# Altium project PCB_Project2.PrjPCB
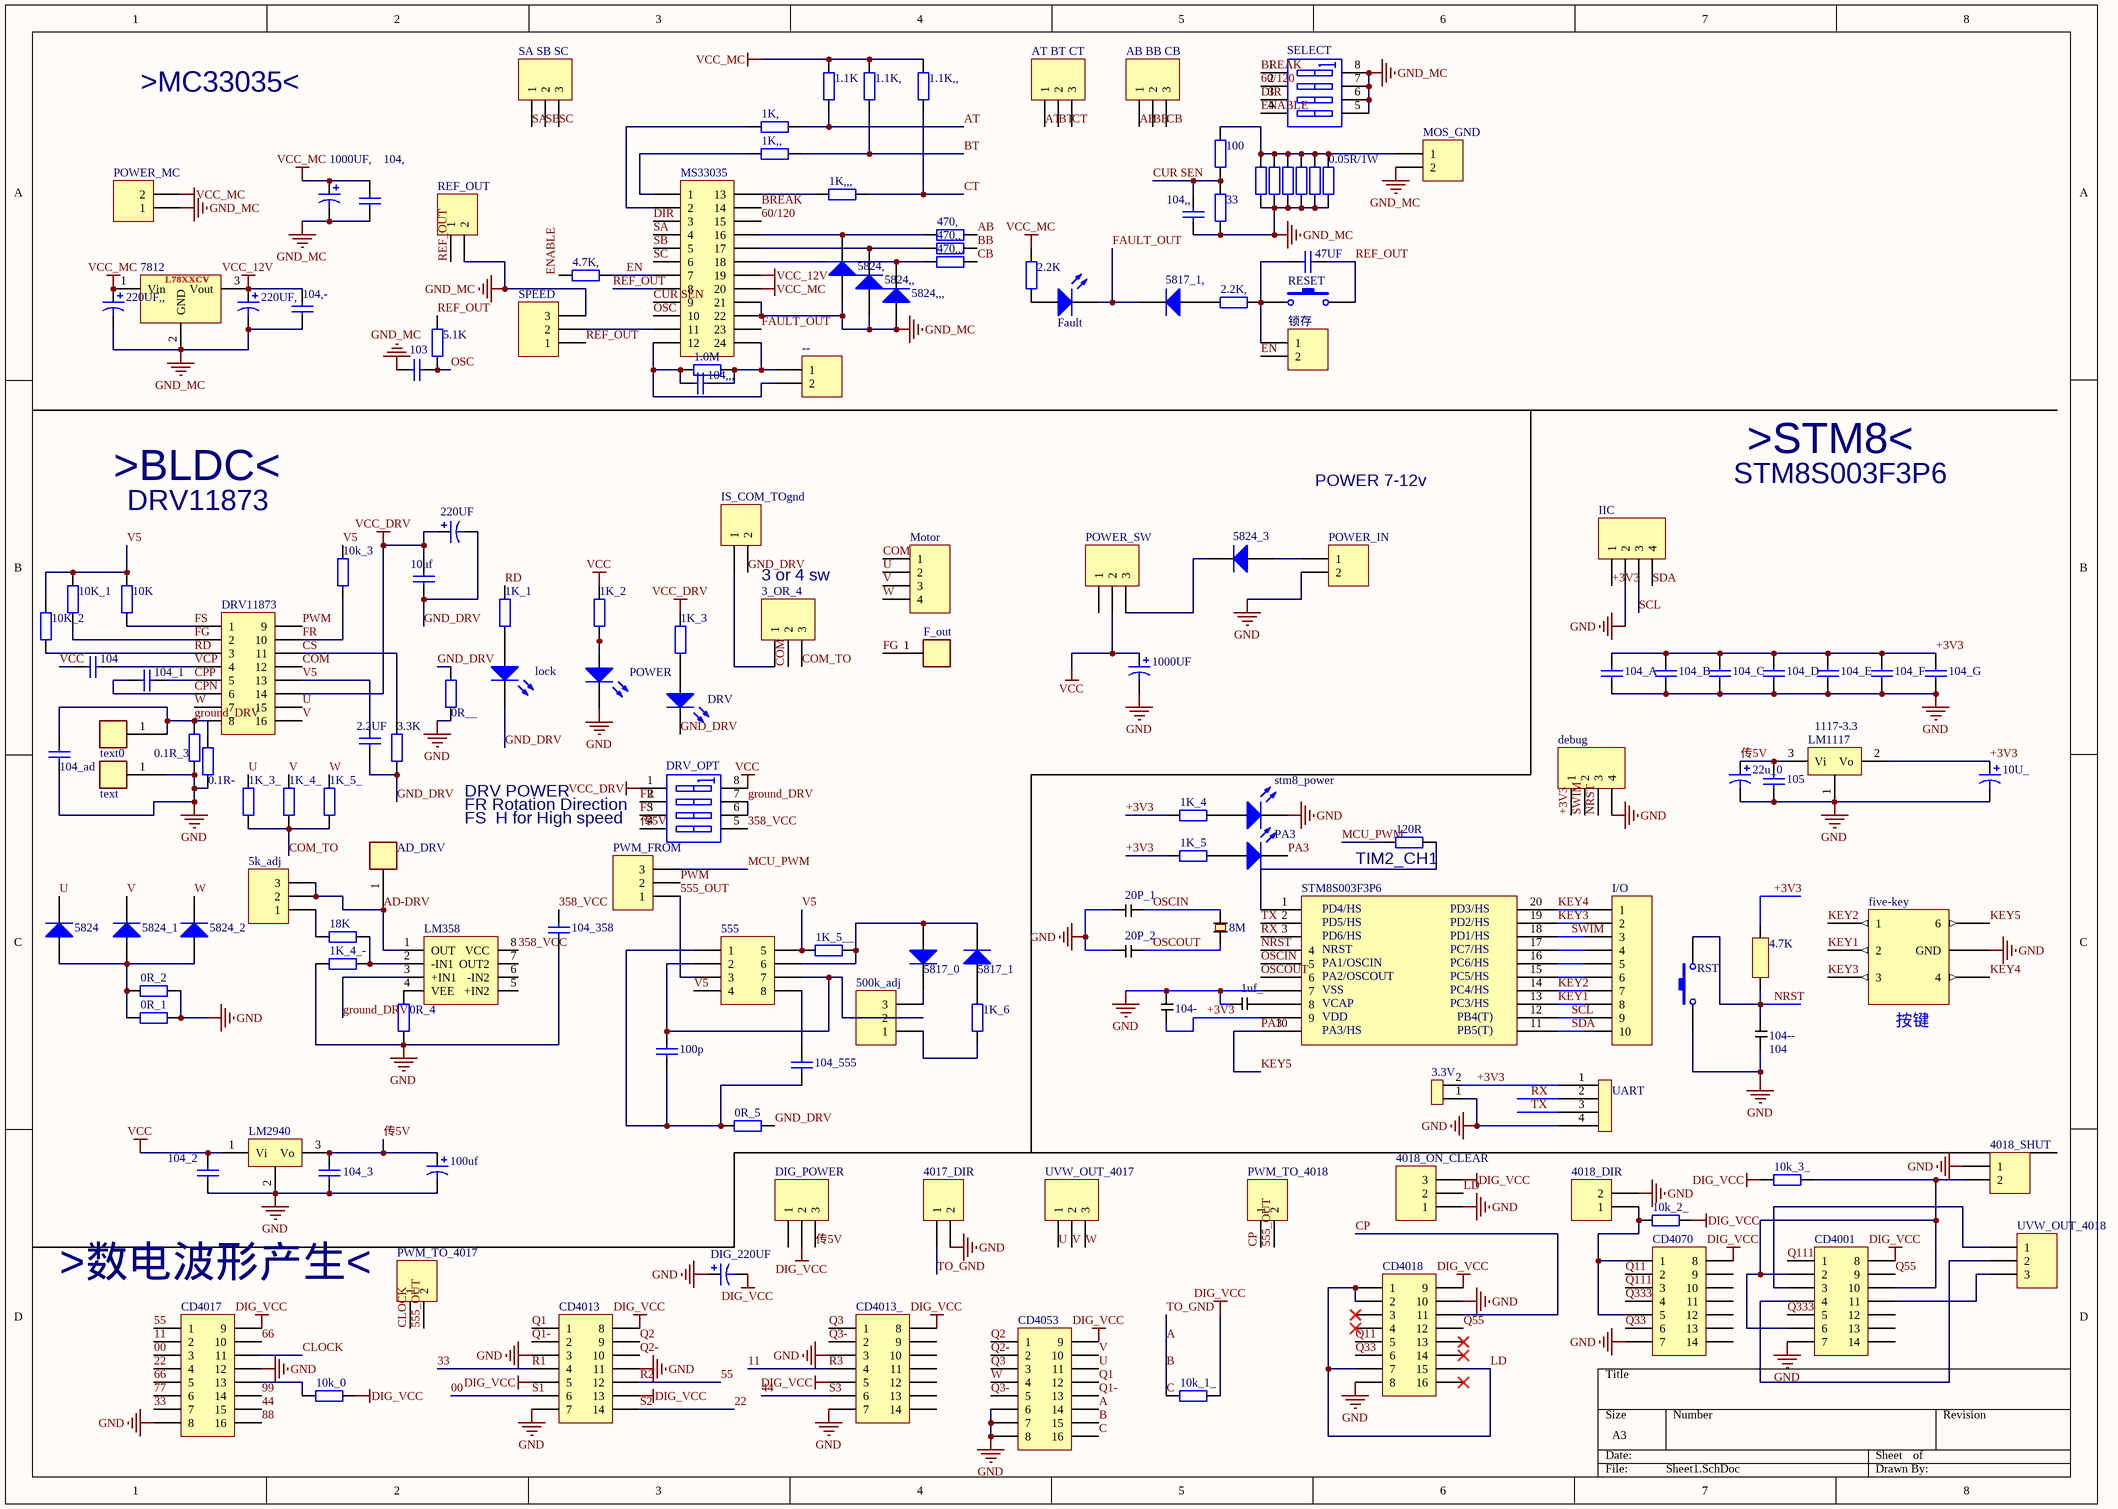
[diagram p0: Sheet1.SchDoc]
1 sheet, 162 parts. Net scope: global (net labels, ports and power ports of the same name join across sheets).
Board file: PCB1.PcbDoc

## Sheet Sheet1.SchDoc
size A3

### Parts
0.1R-  Res2  [RES 0805_1]  (value not drawn)
0.1R_3  Res2  [RES 0805_1]  (value not drawn)
0.05R/1W  Res2  [RES 0805_1]  (value not drawn)
0R_1  Res2  [RES 0805_1]  (value not drawn)
0R_2  Res2  [RES 0805_1]  (value not drawn)
0R_4  Res2  [RES 0805_1]  (value not drawn)
0R_5  Res2  [RES 0805_1]  (value not drawn)
0R__  Res2  [RES 0805_1]  (value not drawn)
1.0M  Res2  [RES 0805_1]  (value not drawn)
1.1K  Res2  [RES 0805_1]  (value not drawn)
1.1K,  Res2  [RES 0805_1]  (value not drawn)
1.1K,,  Res2  [RES 0805_1]  (value not drawn)
1K,  Res2  [RES 0805_1]  (value not drawn)
1K,,  Res2  [RES 0805_1]  (value not drawn)
1K,,,  Res2  [RES 0805_1]  (value not drawn)
1K_1  Res2  [RES 0805_1]  (value not drawn)
1K_2  Res2  [RES 0805_1]  (value not drawn)
1K_3  Res2  [RES 0805_1]  (value not drawn)
1K_3_  Res2  [RES 0805_1]  (value not drawn)
1K_4  Res2  [RES 0805_1]  (value not drawn)
1K_4_  Res2  [RES 0805_1]  (value not drawn)
1K_4_-  Res2  [RES 0805_1]  (value not drawn)
1K_5  Res2  [RES 0805_1]  (value not drawn)
1K_5_  Res2  [RES 0805_1]  (value not drawn)
1K_5__  Res2  [RES 0805_1]  (value not drawn)
1K_6  Res2  [RES 0805_1]  (value not drawn)
1uf_  1UF  [0805]  (value not drawn)
2.2K  Res2  [RES 0805_1]  (value not drawn)
2.2K,  Res2  [RES 0805_1]  (value not drawn)
2.2UF  Cap  [0805_C]  (value not drawn)
3.3K  Res2  [RES 0805_1]  (value not drawn)
3.3V  PIN 2  [HDR1X2]  (value not drawn)
3_OR_4  MHDR1X3  [MHDR1X3]  (value not drawn)
4.7K  4.7K  [0805-1]  (value not drawn)
4.7K,  Res2  [RES 0805_1]  (value not drawn)
5.1K  Res2  [RES 0805_1]  (value not drawn)
5k_adj  Header 3  [pot（正方形）]  (value not drawn)
8M  8M  [XTAL2]  (value not drawn)
10K  Res2  [RES 0805_1]  (value not drawn)
10k_0  Res2  [RES 0805_1]  (value not drawn)
10K_1  Res2  [RES 0805_1]  (value not drawn)
10k_1_  Res2  [RES 0805_1]  (value not drawn)
10K_2  Res2  [RES 0805_1]  (value not drawn)
10k_2_  Res2  [RES 0805_1]  (value not drawn)
10k_3  Res2  [RES 0805_1]  (value not drawn)
10k_3_  Res2  [RES 0805_1]  (value not drawn)
10U_  Cap Pol1  [0805-1]  (value not drawn)
10uf  Cap  [0805_C]  (value not drawn)
18K  Res2  [RES 0805_1]  (value not drawn)
20P_1  20P  [0805]  (value not drawn)
20P_2  20P  [0805]  (value not drawn)
22u_0  Cap Pol1  [0805-1]  (value not drawn)
33  Res2  [RES 0805_1]  (value not drawn)
47UF  Cap  [0805_C]  (value not drawn)
100  Res2  [RES 0805_1]  (value not drawn)
100p  Cap  [0805_C]  (value not drawn)
100uf  Cap Pol1  [capso_8*10]  (value not drawn)
103  Cap  [0805_C]  (value not drawn)
104  Cap  [0805_C]  (value not drawn)
104,  Cap  [0805_C]  (value not drawn)
104,,  Cap  [0805_C]  (value not drawn)
104,,,  Cap  [0805_C]  (value not drawn)
104,-  Cap  [0805_C]  (value not drawn)
104-  104  [0805]  (value not drawn)
104--  104  [0805]
104_1  Cap  [0805_C]  (value not drawn)
104_2  Cap  [0805]  (value not drawn)
104_3  Cap  [0805]  (value not drawn)
104_358  Cap  [0805_C]  (value not drawn)
104_555  Cap  [0805_C]  (value not drawn)
104_A  104  [0805]  (value not drawn)
104_ad  Cap  [0805_C]  (value not drawn)
104_B  104  [0805]  (value not drawn)
104_C  104  [0805]  (value not drawn)
104_D  104  [0805]  (value not drawn)
104_E  104  [0805]  (value not drawn)
104_F  104  [0805]  (value not drawn)
104_G  104  [0805]  (value not drawn)
105  105  [0805]  (value not drawn)
120R  Res2  [RES 0805_1]  (value not drawn)
220UF  Cap Pol1  [capso_8*10]  (value not drawn)
220UF,  Cap Pol1  [capso_8*10]  (value not drawn)
220UF,,  Cap Pol1  [capso_8*10]  (value not drawn)
470,  Res2  [RES 0805_1]  (value not drawn)
470,,  Res2  [RES 0805_1]  (value not drawn)
470,,,  Res2  [RES 0805_1]  (value not drawn)
500k_adj  Header 3  [pot（正方形）]  (value not drawn)
555  Header 4X2A  [SOP8]  (value not drawn)
1000UF  Cap Pol1  [CAPSO_10*10]  (value not drawn)
1000UF,  Cap Pol1  [CAPSO_10*10]  (value not drawn)
1117-3.3  LM1117  [SOT223]  (value not drawn)
4017_DIR  Header 2  [HDR1X2]  (value not drawn)
4018_DIR  Header 2  [HDR1X2]  (value not drawn)
4018_ON_CLEAR  MHDR1X3  [MHDR1X3]  (value not drawn)
4018_SHUT  Header 2  [HDR1X2]  (value not drawn)
5817_0  1N5819  [LED_0805]  (value not drawn)
5817_1  1N5819  [LED_0805]  (value not drawn)
5817_1,  1N5819  [LED_0805]  (value not drawn)
5824  1N5819  [DIODE-SMA]  (value not drawn)
5824,  1N5819  [DIODE-SMA]  (value not drawn)
5824,,  1N5819  [DIODE-SMA]  (value not drawn)
5824,,,  1N5819  [DIODE-SMA]  (value not drawn)
5824_1  1N5819  [DIODE-SMA]  (value not drawn)
5824_2  1N5819  [DIODE-SMA]  (value not drawn)
5824_3  1N5819  [DIODE-SMA]  (value not drawn)
7812  L78XXCV  [TO-220B]  (value not drawn)
,,  Res2  [RES 0805_1]  (value not drawn)
,,,  Res2  [RES 0805_1]  (value not drawn)
,,,,  Res2  [RES 0805_1]  (value not drawn)
,,,,,  Res2  [RES 0805_1]  (value not drawn)
,,,,,,  Res2  [RES 0805_1]  (value not drawn)
--  Header 2  [HDR1X2]  (value not drawn)
AB_BB_CB  Header 3  [HDR1X3]  (value not drawn)
AD_DRV  1PIN  [P]  (value not drawn)
AT_BT_CT  Header 3  [HDR1X3]  (value not drawn)
CD4001  Header 7X2A  [DIP14]  (value not drawn)
CD4013  Header 7X2A  [SOP-14P]  (value not drawn)
CD4013_  Header 7X2A  [SOP-14P]  (value not drawn)
CD4017  Header 8X2A  [sop16(2003)]  (value not drawn)
CD4018  Header 8X2A  [DIP16]  (value not drawn)
CD4053  Header 8X2A  [sop16(2003)]  (value not drawn)
CD4070  Header 7X2A  [DIP14]  (value not drawn)
debug  Header 4  [HDR1X4]  (value not drawn)
DIG_220UF  Cap Pol1  [capso_8*10]  (value not drawn)
DIG_POWER  MHDR1X3  [MHDR1X3]  (value not drawn)
DRV  LED  [LED_0805]  (value not drawn)
DRV11873  Header 8X2A  [TSSOP16]  (value not drawn)
DRV_OPT  SW DIP-4  [SW8_4BIT]  (value not drawn)
F_out  1PIN  [P]  (value not drawn)
Fault  LED  [LED_0805]  (value not drawn)
five-key  five_key  [五向按键]  (value not drawn)
I/O  Header 10  [HDR1X10]  (value not drawn)
IIC  Header 4  [HDR1X4]  (value not drawn)
IS_COM_TOgnd  Header 2  [HDR1X2]  (value not drawn)
LM358  10358  [SOP8]  (value not drawn)
LM2940  LM2940_2  [SOT223]  (value not drawn)
lock  LED  [LED_0805]  (value not drawn)
MOS_GND  Header 2  [ED120/2DS_1]  (value not drawn)
Motor  Header 4  [ED120/4DS_1]  (value not drawn)
MS33035  Header 12X2A  [SO-24W]  (value not drawn)
PA3  LED  [LED_0805]  (value not drawn)
POWER  LED  [LED_0805]  (value not drawn)
POWER_IN  Header 2  [ED120/2DS_1]  (value not drawn)
POWER_MC  Header 2  [ED120/2DS_1]  (value not drawn)
POWER_SW  MHDR1X3  [MHDR1X3]  (value not drawn)
PWM_FROM  MHDR1X3  [MHDR1X3]  (value not drawn)
PWM_TO_4017  Header 2  [HDR1X2]  (value not drawn)
PWM_TO_4018  Header 2  [HDR1X2]  (value not drawn)
REF_OUT  Header 2  [HDR1X2]  (value not drawn)
RESET  SW-PB  [SW_PB2_A1]  (value not drawn)
RST  SW-PB  [SW_PB2_A1]  (value not drawn)
SA_SB_SC  Header 3  [HDR1X3]  (value not drawn)
SELECT  SW DIP-4  [SW8_4BIT]  (value not drawn)
SPEED  MHDR1X3  [pot（正方形）]  (value not drawn)
stm8_power  LED  [LED_0805]  (value not drawn)
STM8S003F3P6  STM8S003F3P6  [TSSOP20]  (value not drawn)
text  1PIN  [P]  (value not drawn)
text0  1PIN  [P]  (value not drawn)
UART  PIN 4  [HDR1X4]  (value not drawn)
UVW_OUT_4017  Header 3  [HDR1X3]  (value not drawn)
UVW_OUT_4018  Header 3  [HDR1X3]  (value not drawn)
锁存  Header 2  [HDR1X2]  (value not drawn)

### Nets
DIG_VCC: 10k_0.2 10k_1_.2 10k_2_.2 10k_3_.1 4018_ON_CLEAR.3 CD4001.8 CD4013.5 CD4013.8 CD4013.13 CD4013_.5 CD4013_.8 CD4017.9 CD4018.9 CD4053.9 CD4070.8 DIG_220UF.2 DIG_POWER.2
GND: 0.1R-.1 0.1R_3.1 0R_1.1 0R_2.1 0R_4.2 0R__.1 1K_4_-.2 1uf_.2 3.3V.1 10U_.2 20P_1.1 20P_2.1 22u_0.2 100uf.2 104-.2 104--.1 104_2.1 104_3.1 104_358.1 104_A.2 104_ad.1 104_B.2 104_C.2 104_D.2 104_E.2 104_F.2 104_G.2 105.2 1000UF.2 1117-3.3.1(COM) 4017_DIR.2 4018_DIR.2 4018_ON_CLEAR.1 4018_SHUT.1 CD4001.7 CD4013.3 CD4013.7 CD4013.11 CD4013_.3 CD4013_.7 CD4017.8 CD4017.12 CD4018.8 CD4018.10 CD4053.6 CD4053.7 CD4053.8 CD4070.7 debug.4 DIG_220UF.1 five-key.5(GND) IIC.2 LM2940.2 POWER.2(K) POWER_IN.2 RST.1 stm8_power.2(K) STM8S003F3P6.7 text.1 UART.4
GND_MC: 0.05R/1W.2 33.1 103.2 104,.1 104,,.2 104,-.1 220UF,.2 220UF,,.2 1000UF,.2 5824,.1(A) 5824,,.1(A) 5824,,,.1(A) 7812.2(GND) ,,.2 ,,,.2 ,,,,.2 ,,,,,.2 ,,,,,,.2 MOS_GND.2 MS33035.21 MS33035.22 POWER_MC.1 REF_OUT.2 SELECT.5(B4) SELECT.6(B3) SELECT.7(B2) SELECT.8(B1) SPEED.3
VCC: 1K_2.2 104.1 104_2.2 1000UF.1 DRV_OPT.8(B1) LM2940.1(Vi) POWER_SW.2
VCC_12V: 104,-.2 220UF,.1 7812.3(Vout) MS33035.19
VCC_DRV: 1K_3.2 10uf.2 220UF.1 DRV11873.14 DRV_OPT.1(A1)
VCC_MC: 1.1K.1 1.1K,.1 1.1K,,.1 2.2K.1 104,.2 220UF,,.1 1000UF,.1 7812.1(Vin) MS33035.20 POWER_MC.2
00: CD4013.6 CD4017.3  [also labelled S1]
11: CD4013_.4 CD4017.2  [also labelled R3]
22: CD4013.14 CD4017.4  [also labelled S2]
33: CD4013.4 CD4017.7  [also labelled R1]
44: CD4013_.6 CD4017.15  [also labelled S3]
55: CD4013.12 CD4017.1  [also labelled R2]
60/120: MS33035.15 SELECT.2(A2)
66: CD4017.5 CD4017.10
77: CD4017.6
88: CD4017.16
99: CD4017.14
358_VCC: 104_358.2 DRV_OPT.5(B4) LM358.8(VCC)
555_OUT: 555.3 PWM_FROM.1 PWM_TO_4017.2 PWM_TO_4018.2
+3V3: 1K_4.2 1K_5.2 3.3V.2 4.7K.2 10U_.1 104-.1 104_A.1 104_B.1 104_C.1 104_D.1 104_E.1 104_F.1 104_G.1 1117-3.3.2(Vo) debug.1 IIC.1 STM8S003F3P6.9 UART.1
A: 10k_1_.1 4017_DIR.1 CD4053.14 CD4053.15 CD4053.16  [also labelled B, C, TO_GND]
AB: 470,.1 AB_BB_CB.1
AD-DRV: 5k_adj.2 5k_adj.3 AD_DRV.1 LM358.1(OUT)
AT: 1.1K.2 1K,.1 AT_BT_CT.1
BB: 470,,.1 AB_BB_CB.2
BREAK: MS33035.14 SELECT.1(A1)
BT: 1.1K,.2 1K,,.1 AT_BT_CT.2
CB: 470,,,.1 AB_BB_CB.3
CLOCK: CD4017.11 PWM_TO_4017.1
COM: 3_OR_4.2 DRV11873.12 Motor.1
COM_TO: 1K_3_.1 1K_4_.1 1K_5_.1 3_OR_4.3
CP: CD4018.11 PWM_TO_4018.1
CPN: 104_1.1 DRV11873.6
CPP: 104_1.2 DRV11873.5
CS: 3.3K.2 DRV11873.11
CT: 1.1K,,.2 1K,,,.1 AT_BT_CT.3
CUR SEN: 33.2 100.2 104,,.1 MS33035.9
DIR: MS33035.3 SELECT.3(A3)
EN: 4.7K,.2 MS33035.7 锁存.2
ENABLE: 4.7K,.1 SELECT.4(A4)
FAULT_OUT: 5817_1,.2(K) Fault.2(K) MS33035.23
FG: 10K_1.2 DRV11873.2 F_out.1
FR: 10k_3.1 DRV11873.10 DRV_OPT.2(A2)
FS: 10K.1 DRV11873.1 DRV_OPT.3(A3)
GND_DRV: 0R_5.2 0R__.2 2.2UF.1 3.3K.1 10uf.1 220UF.2 DRV.2(K) IS_COM_TOgnd.2 lock.2(K)
ground_DRV: 0.1R-.2 0.1R_3.2 104_ad.2 DRV11873.8 DRV_OPT.6(B3) DRV_OPT.7(B2) LM358.3(+IN1) text0.1
KEY1: five-key.2 I/O.8 STM8S003F3P6.13(TIM1_CH3[TLI][TIM1_CH1N])
KEY2: five-key.1 I/O.7 STM8S003F3P6.14(TIM1_CH4/CLK_CCO/AIN2[TIM1_CH2N])
KEY3: five-key.3 I/O.2 STM8S003F3P6.19(AIN3[TIM2_CH3])
KEY4: five-key.4 I/O.1 STM8S003F3P6.20(AIN4/TIM2_CH2/ADC_ETR)
KEY5: five-key.6 PA3.2(K) STM8S003F3P6.10([SPI_NSS]TIM2_CH3/HS)  [also labelled PA3]
LD: 4018_ON_CLEAR.2 CD4018.1 CD4018.2 CD4018.7 CD4018.15
MCU_PWM: 120R.2 PWM_FROM.3
NRST: 4.7K.1 104--.2 debug.3 RST.2 STM8S003F3P6.4
OSC: 5.1K.1 103.1 MS33035.10
OSCIN: 8M.2 20P_1.2 STM8S003F3P6.5
OSCOUT: 8M.1 20P_2.2 STM8S003F3P6.6
PWM: DRV11873.9 PWM_FROM.2
Q1: CD4013.1 CD4053.12
Q1-: CD4013.2 CD4053.13
Q2: CD4013.9 CD4053.1
Q2-: CD4013.10 CD4053.2
Q3: CD4013_.1 CD4053.3
Q3-: CD4013_.2 CD4053.5
Q11: CD4018.5 CD4070.2
Q33: CD4018.6 CD4070.6
Q55: CD4001.9 CD4018.12
Q111: CD4001.1 CD4070.3
Q333: CD4001.5 CD4070.4
RD: 1K_1.2 10K_2.2 DRV11873.3
REF_OUT: 5.1K.2 47UF.1 MS33035.8 REF_OUT.1 RESET.2 SPEED.1
RX: STM8S003F3P6.3(UART1_RX/AIN6/HS) UART.2
SA: MS33035.4 SA_SB_SC.1
SB: MS33035.5 SA_SB_SC.2
SC: MS33035.6 SA_SB_SC.3
SCL: I/O.9 IIC.3 STM8S003F3P6.12(I2C_SCL[ADC_ETR])
SDA: I/O.10 IIC.4 STM8S003F3P6.11(I2C_SDA[TIM1_BKIN])
SWIM: debug.2 I/O.3 STM8S003F3P6.18(SWIM)
TX: STM8S003F3P6.2(UART1_TX/AIN5/HS) UART.3
U: 1K_3_.2 5824.2(K) CD4053.11 DRV11873.15 Motor.2 UVW_OUT_4017.1
V: 1K_4_.2 5824_1.2(K) CD4053.10 DRV11873.16 Motor.3 UVW_OUT_4017.2
V5: 1K_5__.2 2.2UF.2 10K.2 10K_1.1 10K_2.1 10k_3.2 555.4 555.5 DRV11873.13
VCP: 104.2 DRV11873.4
W: 1K_5_.2 5824_2.2(K) CD4053.4 DRV11873.7 Motor.4 UVW_OUT_4017.3
传5V: 22u_0.1 100uf.1 104_3.2 105.1 1117-3.3.3(Vi) DIG_POWER.3 DRV_OPT.4(A4) LM2940.3(Vo)
Net0.05R/1W_1: 0.05R/1W.1 100.1 ,,.1 ,,,.1 ,,,,.1 ,,,,,.1 ,,,,,,.1 MOS_GND.1
Net0R_1_2: 0R_1.2 0R_2.2 5824.1(A) 5824_1.1(A) 5824_2.1(A)
Net0R_4_1: 0R_4.1 LM358.4(VEE)
Net0R_5_1: 0R_5.1 100p.1 104_555.1 555.1
Net1.0M_1: 1.0M.1 104,,,.2 --.2 MS33035.12
Net1.0M_2: 1.0M.2 104,,,.1 --.1 MS33035.24
Net1K,,,_2: 1K,,,.2 MS33035.13
Net1K,,_2: 1K,,.2 MS33035.1
Net1K,_2: 1K,.2 MS33035.2
Net1K_1_1: 1K_1.1 lock.1(A)
Net1K_2_1: 1K_2.1 POWER.1(A)
Net1K_3_1: 1K_3.1 DRV.1(A)
Net1K_4_1: 1K_4.1 stm8_power.1(A)
Net1K_4_-_1: 1K_4_-.1 18K.2 LM358.2(-IN1)
Net1K_5_1: 1K_5.1 PA3.1(A)
Net1K_5___1: 1K_5__.1 555.6 5817_0.1(A) 5817_1.2(K)
Net1K_6_1: 1K_6.1 5817_1.1(A)
Net1K_6_2: 1K_6.2 500k_adj.1
Net1uf__1: 1uf_.1 STM8S003F3P6.8
Net2.2K,_1: 2.2K,.1 5817_1,.1(A)
Net2.2K,_2: 2.2K,.2 47UF.2 RESET.1 锁存.1
Net2.2K_2: 2.2K.2 Fault.1(A)
Net3_OR_4_1: 3_OR_4.1 IS_COM_TOgnd.1
Net5k_adj_1: 5k_adj.1 18K.1
Net10k_0_1: 10k_0.1 CD4017.13
Net10k_2__1: 10k_2_.1 4018_DIR.1 CD4070.1 CD4070.5
Net10k_3__2: 10k_3_.2 4018_SHUT.2 CD4001.2 CD4001.6 CD4001.10
Net100p_2: 100p.2 500k_adj.2 555.2 555.7
Net104_555_2: 104_555.2 555.8
Net120R_1: 120R.1 STM8S003F3P6.1(UART1_CK/TIM2_CH1/BEEP/HS)
Net470,,,_2: 470,,,.2 5824,,,.2(K) MS33035.18
Net470,,_2: 470,,.2 5824,,.2(K) MS33035.17
Net470,_2: 470,.2 5824,.2(K) MS33035.16
Net500k_adj_3: 500k_adj.3 5817_0.2(K)
Net5824_3_1: 5824_3.1(A) POWER_IN.1
Net5824_3_2: 5824_3.2(K) POWER_SW.3
NetCD4001_3: CD4001.3 UVW_OUT_4018.1
NetCD4001_4: CD4001.4 UVW_OUT_4018.2
NetCD4001_11: CD4001.11 UVW_OUT_4018.3
NetI/O_4: I/O.4 STM8S003F3P6.17(SPI_MISO[TIM1_CH2])
NetI/O_5: I/O.5 STM8S003F3P6.16(SPI_MOSI[TIM1_CH1])
NetI/O_6: I/O.6 STM8S003F3P6.15(SPI_SCK[TIM2_CH1])
NetMS33035_11: MS33035.11 SPEED.2

Not connected (* = marked no-connect by the designer): CD4001 12 13 14; CD4013_ 9 10 11 12 13 14; CD4018 3* 4* 13* 14* 16*; CD4070 9 10 11 12 13 14; DIG_POWER 1; LM358 5(+IN2) 6(-IN2) 7(OUT2); POWER_SW 1

### Notes on the sheet
- >MC33035<
- >BLDC<
- DRV11873
- POWER 7-12v
- STM8S003F3P6
- >STM8<
- (near IS_COM_TOgnd) 3 or 4 sw
- FS  H for High speed
- (near DRV_OPT) FR Rotation Direction
- DRV POWER
- (near 120R) TIM2_CH1
- (near five-key) 按键
- >数电波形产生<
- (in symbol STM8S003F3P6) PD4/HS; PD3/HS; PD5/HS; PD2/HS; PD6/HS; PD1/HS; NRST; PC7/HS; PA1/OSCIN; PC6/HS; PA2/OSCOUT; PC5/HS; VSS; PC4/HS; VCAP; PC3/HS; VDD; PB4(T); PA3/HS; PB5(T)

### Library data of the parts
0.1R- 0.1R_3 0.05R/1W 0R_1 0R_2 0R_4 0R_5 0R__ 1.0M 1.1K 1.1K, 1.1K,, 1K, 1K,, 1K,,, 1K_1-1K_3 1K_3_ 1K_4 1K_4_ 1K_4_- 1K_5 1K_5_ 1K_5__ 1K_6 2.2K 2.2K, 3.3K 4.7K, 5.1K 10K 10k_0 10K_1 10k_1_ 10K_2 10k_2_ 10k_3 10k_3_ 18K 33 100 120R 470, 470,, 470,,, ,, ,,, ,,,, ,,,,, ,,,,,, = Res2: Resistor; Value: 10K; Published: 8-Jun-2000; LatestRevisionDate: 17-Jul-2002; LatestRevisionNote: Re-released for DXP Platform.; PackageReference: AXIAL-0.4; Publisher: Altium Limited; PackageDescription: Axial Device, Thru-Hole; 2 Leads; 0.4 in Pin Spacing
1uf_ 20P_1 20P_2 104- 104-- = CAP 2
2.2UF 10uf 47UF 100p 103 104 104, 104,, 104,,, 104,- 104_1 104_358 104_555 104_ad = Cap: Capacitor; Value: 0.1uF; Published: 8-Jun-2000; LatestRevisionDate: 17-Jul-2002; LatestRevisionNote: Re-released for DXP Platform.; PackageReference: RAD-0.3; Publisher: Altium Limited; PackageDescription: Radial Cap, Thru-Hole; 2 Leads; 0.3 in Pin Spacing
3_OR_4 4018_ON_CLEAR DIG_POWER POWER_SW PWM_FROM SPEED = MHDR1X3: Header, 3-Pin; LatestRevisionDate: 17-Jul-2002; LatestRevisionNote: Re-released for DXP Platform.; Publisher: Altium Limited
4.7K = R
5k_adj 500k_adj AB_BB_CB AT_BT_CT SA_SB_SC UVW_OUT_4017 UVW_OUT_4018 = Header 3: Header, 3-Pin; LatestRevisionDate: 17-Jul-2002; LatestRevisionNote: Re-released for DXP Platform.; Publisher: Altium Limited
8M = XTAL
10U_ 22u_0 = Cap Pol1: Polarized Capacitor (Radial); Value: 22; Published: 8-Jun-2000; LatestRevisionDate: 17-Jul-2002; LatestRevisionNote: Re-released for DXP Platform.; PackageReference: RB7.6-15; Publisher: Altium Limited; PackageDescription: Polarized Capacitor (Radial); 2 Leads
100uf 220UF 220UF, 220UF,, 1000UF 1000UF, DIG_220UF = Cap Pol1: Polarized Capacitor (Radial); Value: 10uF; Published: 8-Jun-2000; LatestRevisionDate: 17-Jul-2002; LatestRevisionNote: Re-released for DXP Platform.; PackageReference: RB7.6-15; Publisher: Altium Limited; PackageDescription: Polarized Capacitor (Radial); 2 Leads
104_2 104_3 = Cap: Capacitor; Value: 104; Published: 8-Jun-2000; LatestRevisionDate: 17-Jul-2002; LatestRevisionNote: Re-released for DXP Platform.; PackageReference: RAD-0.3; Publisher: Altium Limited; PackageDescription: Radial Cap, Thru-Hole; 2 Leads; 0.3 in Pin Spacing
104_A 104_B 104_C 104_D 104_E 104_F 104_G 105 = Cap: Capacitor; Value: 100pF; Published: 8-Jun-2000; LatestRevisionDate: 17-Jul-2002; LatestRevisionNote: Re-released for DXP Platform.; PackageReference: RAD-0.3; Publisher: Altium Limited; PackageDescription: Radial Cap, Thru-Hole; 2 Leads; 0.3 in Pin Spacing
555 = Header 4X2A: Header, 4-Pin, Dual row; pin to pad: 5>8 6>7 7>6 8>5; LatestRevisionDate: 17-Jul-2002; LatestRevisionNote: Re-released for DXP Platform.; Publisher: Altium Limited
1117-3.3 = Component_1
4017_DIR 4018_DIR 4018_SHUT -- IS_COM_TOgnd MOS_GND POWER_IN POWER_MC PWM_TO_4017 PWM_TO_4018 REF_OUT 锁存 = Header 2: Header, 2-Pin; LatestRevisionDate: 17-Jul-2002; LatestRevisionNote: Re-released for DXP Platform.; Publisher: Altium Limited
5817_0 5817_1 5817_1, 5824 5824, 5824,, 5824,,, 5824_1-5824_3 = Diode 1N4001: 1 Amp General Purpose Rectifier; Published: 8-Jun-2000; LatestRevisionDate: 17-Jul-2002; LatestRevisionNote: Re-released for DXP Platform.; DatasheetDocument: 1998; PackageDocument: Aug-1999; PackageReference: DO-41; Publisher: Altium Limited; Code_JEDEC: DO-204-AL; ComponentLink1Description: Manufacturer Link; ComponentLink1URL: http://www.fairchildsemi.com/; ComponentLink2Description: Datasheet; ComponentLink2URL: http://www.fairchildsemi.com/ds/1N%2F1N4001.pdf
7812 = L78XXCV: ST POSITIVE VOLTAGE REGULATORS
CD4001 CD4013 CD4013_ CD4070 = Header 7X2A: Header, 7-Pin, Dual row; pin to pad: 8>14 9>13 10>12 12>10 13>9 14>8; LatestRevisionDate: 17-Jul-2002; LatestRevisionNote: Re-released for DXP Platform.; Publisher: Altium Limited
CD4017 CD4018 CD4053 DRV11873 = Header 8X2A: Header, 8-Pin, Dual row; pin to pad: 9>16 10>15 11>14 12>13 13>12 14>11 15>10 16>9; LatestRevisionDate: 17-Jul-2002; LatestRevisionNote: Re-released for DXP Platform.; Publisher: Altium Limited
debug IIC Motor = Header 4: Header, 4-Pin; LatestRevisionDate: 17-Jul-2002; LatestRevisionNote: Re-released for DXP Platform.; Publisher: Altium Limited
DRV_OPT SELECT = SW DIP-4: 编码开关; Published: 24-Mar-1999; LatestRevisionDate: 17-Jul-2002; LatestRevisionNote: Re-released for DXP Platform.; PackageReference: SO8; Publisher: Altium Limited; Code_JEDEC: MS-012-AA; Code_IPC: SO8
I/O = Header 10: Header, 10-Pin; LatestRevisionDate: 17-Jul-2002; LatestRevisionNote: Re-released for DXP Platform.; Publisher: Altium Limited
LM2940 = LM2940
MS33035 = Header 12X2A: Header, 12-Pin, Dual row; pin to pad: 13>24 14>23 15>22 16>21 17>20 18>19 19>18 20>17 21>16 22>15 23>14 24>13; LatestRevisionDate: 17-Jul-2002; LatestRevisionNote: Re-released for DXP Platform.; Publisher: Altium Limited
RESET RST = SW-PB: 微动开关; Published: 24-Mar-1999; LatestRevisionDate: 17-Jul-2002; LatestRevisionNote: Re-released for DXP Platform.; PackageReference: SPST-2; Publisher: Altium Limited